# EAGLE schematic 2DD-17-mk-1.3 (EAGLE 7.5.0)
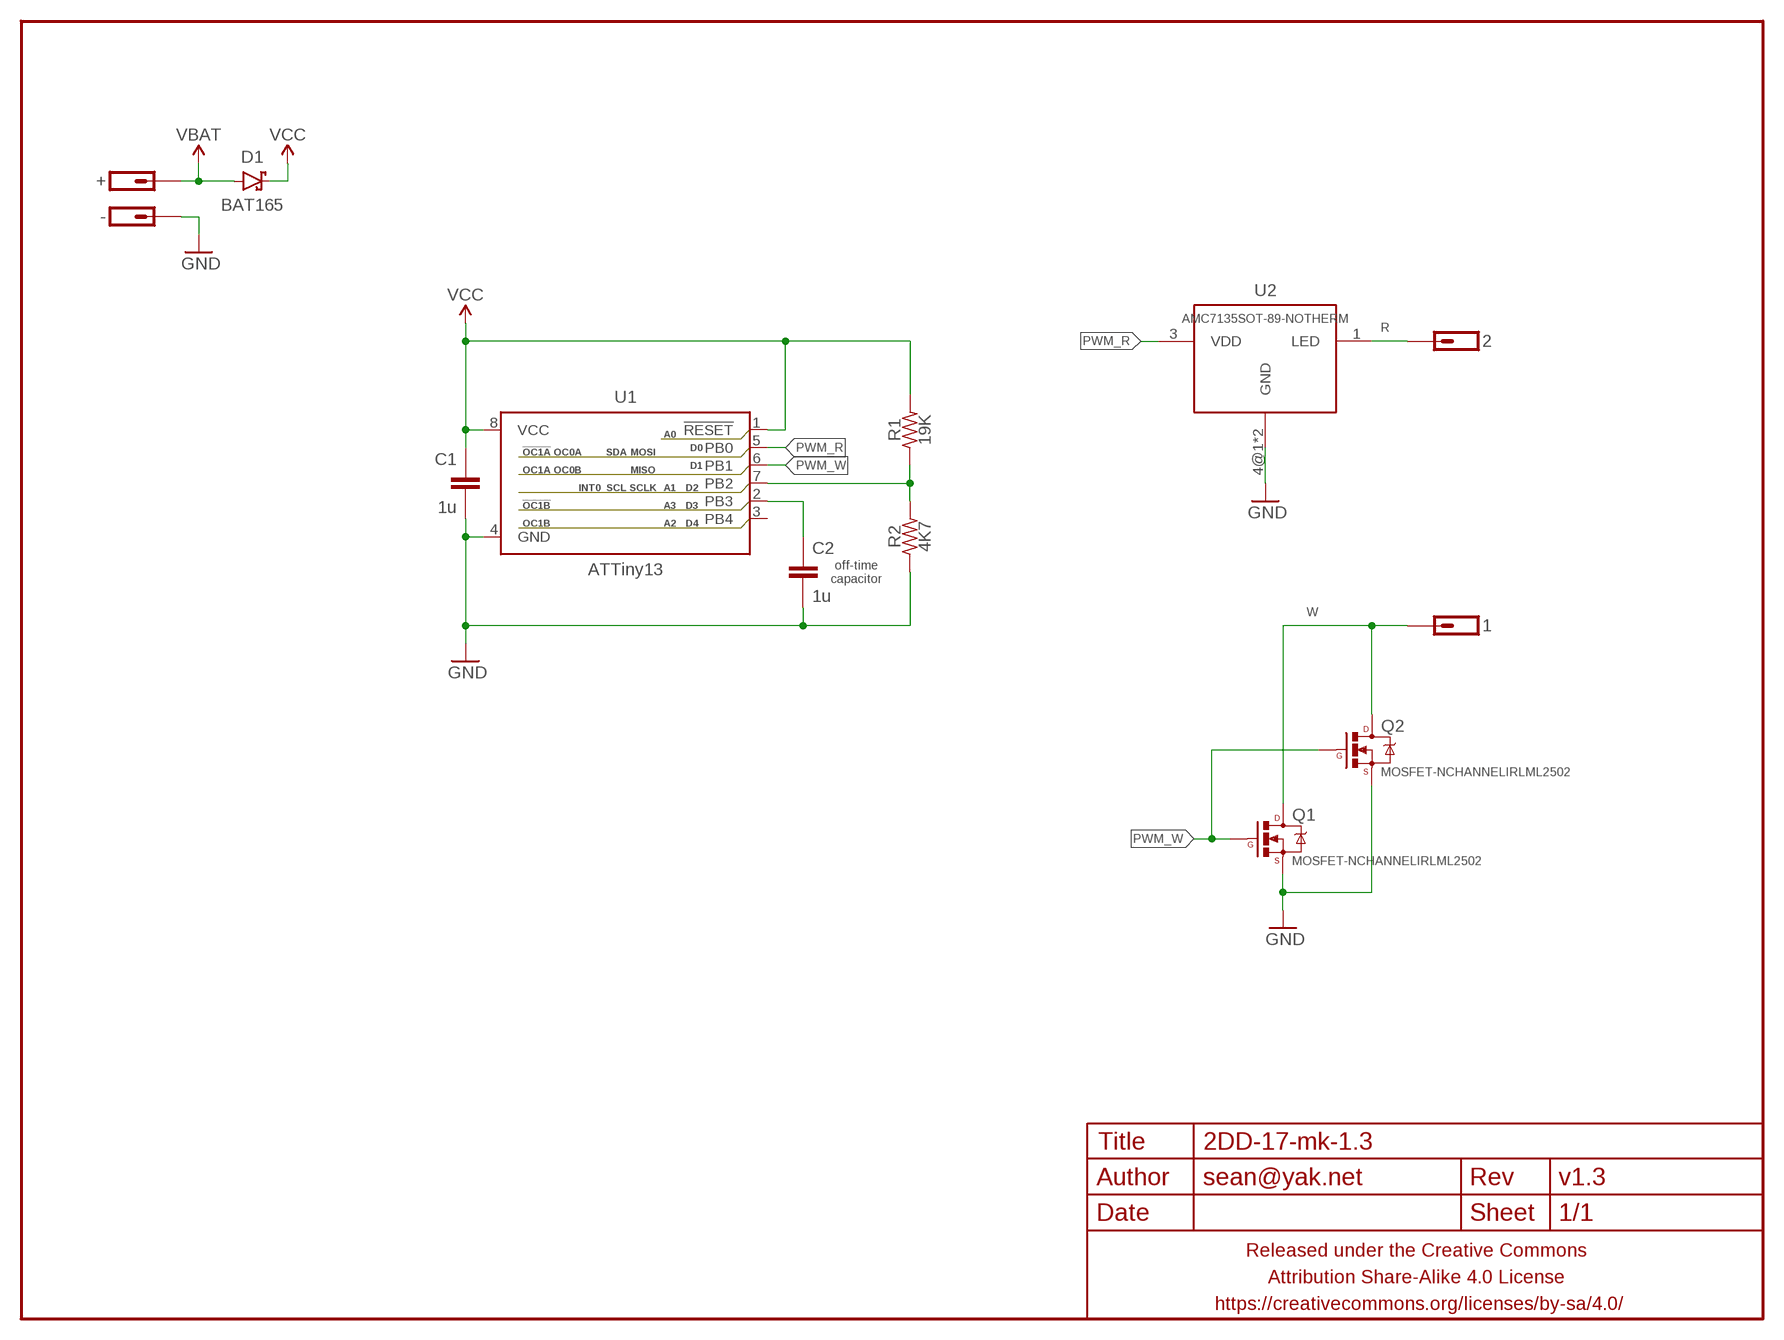
[diagram p0: schematic, sheet 1]

## Parts
1  M01SMD-1.25MM-DIA  [1X01-SMD-1.25MM-DIA-NS]
2  M01SMD-1.25MM-DIA  [1X01-SMD-1.25MM-DIA-NS]
+  M01PTH-1MM-CIR-NS  [1X01-1MM-CIR-NS]
-  M01NOT-A-VIA-NOPE  [1X01_NOSILK_NOSTOP]
C1  1u  CAPACITOR-CERAMICC0603-TIGHTER  [C0603-TIGHTER]
C2  1u  CAPACITOR-CERAMICC0603-TIGHTER  [C0603-TIGHTER]
D1  BAT165  DIODE-SCHOTTKYSOD323  [SOD323-SCHOTTKY]
FRAME1  FRAME-LETTERNO_PACKAGE  [DUMMY]
Q1  MOSFET-NCHANNELIRLML2502  [SOT23]
Q2  MOSFET-NCHANNELIRLML2502  [SOT23]
R1  19K  RESISTORR0603-TIGHTER  [R0603-TIGHTER]
R2  4K7  RESISTORR0603-TIGHTER  [R0603-TIGHTER]
U1  ATTiny13  ATTINY13SOIC-NARROWPADS  [SO08-NARROWER]
U2  AMC7135SOT-89-NOTHERM  [SOT89-NOTHERM]

## Nets
GND: -.P$1 C1.2 C2.2 Q1.2(S) Q2.2(S) R2.1 U1.4(GND) U2.4@1(GND) U2.4@2(GND)
N$1: R1.1 R2.2 U1.7(PB2)
N$2: C2.1 U1.2(PB3)
PWM_R: U1.5(PB0) U2.3(VDD)
PWM_W: Q1.1(G) Q2.1(G) U1.6(PB1)
R: 2.P$1 U2.1(LED)
VBAT: +.1 D1.A
VCC: C1.1 D1.C R1.2 U1.1(!RESET) U1.8(VCC)
W: 1.P$1 Q1.3(D) Q2.3(D)
Unconnected: U1.3(PB4)

## Notes on the sheet
- off-time
  capacitor

## Library data of the parts
1 2 + - = a_parts:M01: Header 1 Standard 1-pin 0.1" header. Use with straight break away headers (SKU : PRT-00116), right angle break away headers (PRT-00553), swiss pins (PRT-00743), machine pins (PRT-00117), and female headers (PRT-00115).
C1 C2 = a_parts:CAPACITOR-CERAMIC: CAPACITOR, European symbol
D1 = a_parts:DIODE-SCHOTTKY: Schottky diodes in SFE's production catalog BAT20J 1A 23V 0.62Vf RB751 120mA 40V 0.37Vf PMEG4005EJ 0.5A 40V 0.42Vf MBRA140 1A 40V 0.5Vf B340A 3A 40V SMA
FRAME1 = a_parts:FRAME-LETTER: Schematic Frame Standard 8.5x11 US Letter frame; DESIGNER: sean@yak.net; VERSION: v1.3
Q1 Q2 = a_parts:MOSFET-NCHANNEL: Common NMOSFET Parts MFG P/N Store ID Prod ID FDD8780 TRANS-09984 SI7820DN TRANS-11055 FDS6630A IC-08089 2N7002PW TRANS-11151 FQP30N06L COM-10213 TRANS-10060 BSS123LT1G TRANS-08345 BSS138 TRANS-00830 BS170 2N7000
R1 R2 = a_parts:RESISTOR: RESISTOR, American symbol
U1 = a_parts:ATTINY13: Atmel 8-pin 1kB flash uC
U2 = a_parts:AMC7135